# Altium project Robokinesis.PrjPcb
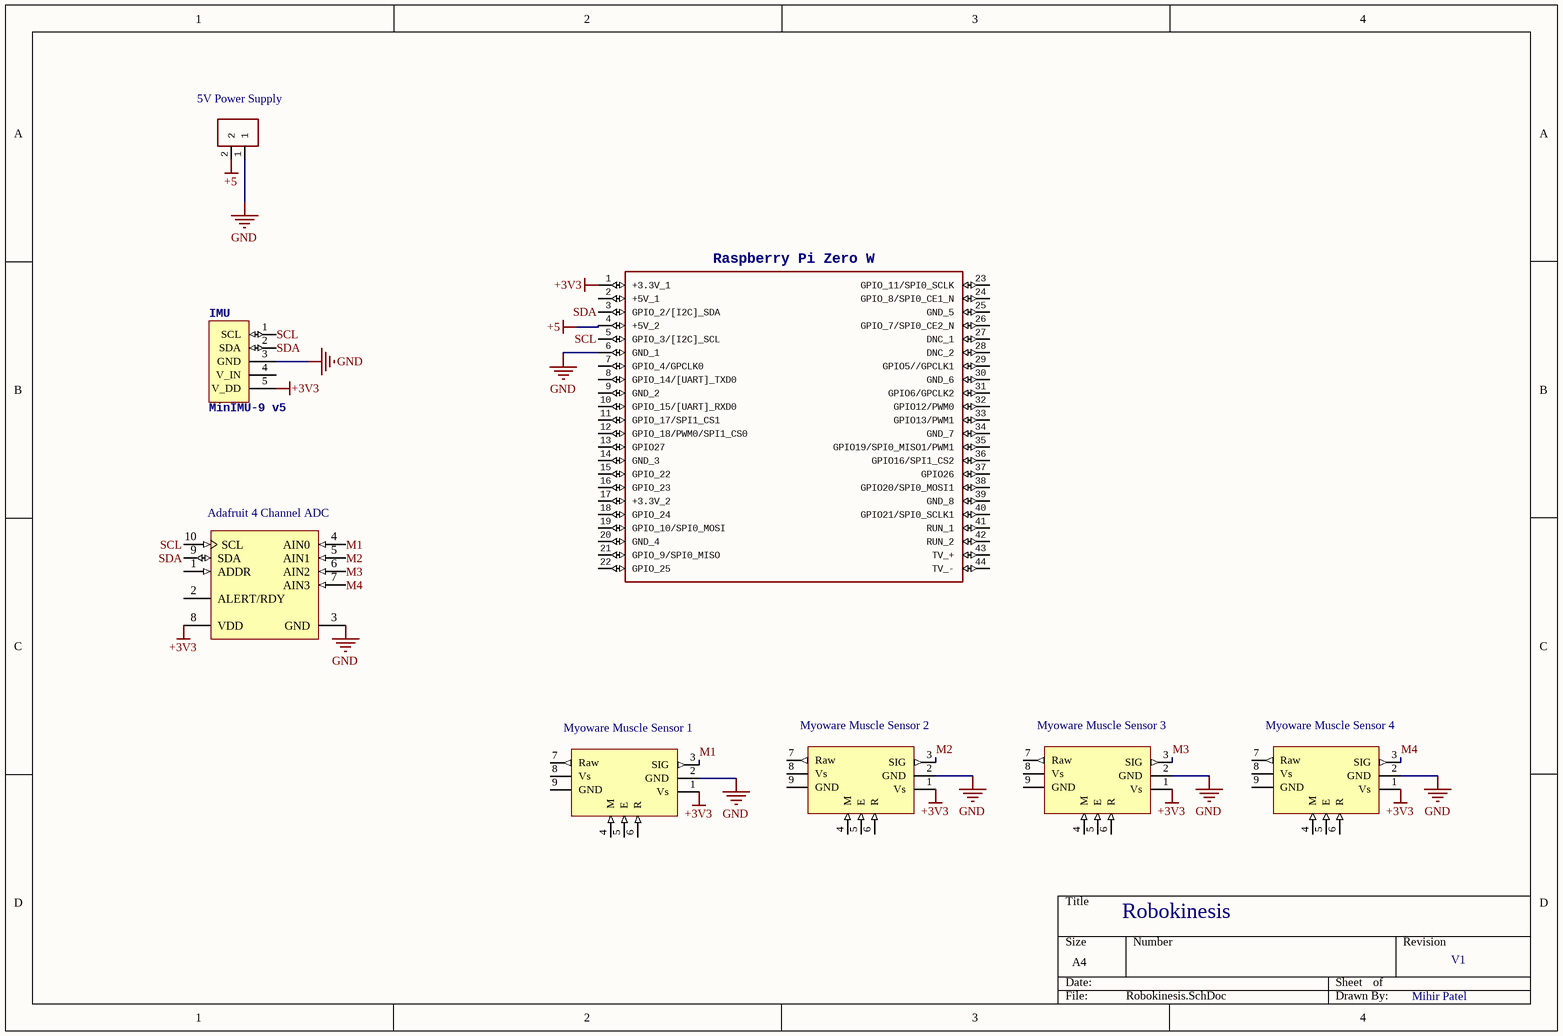
[diagram p0: Robokinesis.SchDoc]
1 sheet, 8 parts. Net scope: global (net labels, ports and power ports of the same name join across sheets).

## Sheet Robokinesis.SchDoc
size A4; SheetNumber: 1; SheetTotal: 1

### Parts
Adafruit_4_Channel_ADC  ADS1115IRUGT  [TI-RUG10_V]  (value not drawn)
IMU  MinIMU-9 v5  [HDR1X5]
Myoware_Muscle_Sensor_1  Myoware Muscle Sensor  (value not drawn)
Myoware_Muscle_Sensor_2  Myoware Muscle Sensor  (value not drawn)
Myoware_Muscle_Sensor_3  Myoware Muscle Sensor  (value not drawn)
Myoware_Muscle_Sensor_4  Myoware Muscle Sensor  (value not drawn)
Raspberry_Pi_Zero_W  Raspberry Pi Zero W (v1.3) Single-board Computers   Source:  Datasheet  [RASPBERRYPIZEROWV13]  (value not drawn)  (mechanical)
XT?  Connector 2 pins  [AMASS_XT60PB-M]  (value not drawn)

### Nets
+3V3: Adafruit_4_Channel_ADC.8(VDD) IMU.5(V_DD) Myoware_Muscle_Sensor_1.1(Vs) Myoware_Muscle_Sensor_2.1(Vs) Myoware_Muscle_Sensor_3.1(Vs) Myoware_Muscle_Sensor_4.1(Vs) Raspberry_Pi_Zero_W.1(+3.3V_1)
+5: Raspberry_Pi_Zero_W.4(+5V_2) XT?.2
GND: Adafruit_4_Channel_ADC.3(GND) IMU.3(GND) Myoware_Muscle_Sensor_1.2(GND) Myoware_Muscle_Sensor_2.2(GND) Myoware_Muscle_Sensor_3.2(GND) Myoware_Muscle_Sensor_4.2(GND) Raspberry_Pi_Zero_W.6(GND_1) XT?.1
M1: Adafruit_4_Channel_ADC.4(AIN0) Myoware_Muscle_Sensor_1.3(SIG)
M2: Adafruit_4_Channel_ADC.5(AIN1) Myoware_Muscle_Sensor_2.3(SIG)
M3: Adafruit_4_Channel_ADC.6(AIN2) Myoware_Muscle_Sensor_3.3(SIG)
M4: Adafruit_4_Channel_ADC.7(AIN3) Myoware_Muscle_Sensor_4.3(SIG)
SCL: Adafruit_4_Channel_ADC.10(SCL) IMU.1(SCL) Raspberry_Pi_Zero_W.5(GPIO_3/[I2C]_SCL)
SDA: Adafruit_4_Channel_ADC.9(SDA) IMU.2(SDA) Raspberry_Pi_Zero_W.3(GPIO_2/[I2C]_SDA)

Not connected (* = marked no-connect by the designer): Adafruit_4_Channel_ADC 1(ADDR) 2(ALERT/RDY); IMU 4(V_IN); Myoware_Muscle_Sensor_1 4(M) 5(E) 6(R) 7(Raw) 8(Vs) 9(GND); Myoware_Muscle_Sensor_2 4(M) 5(E) 6(R) 7(Raw) 8(Vs) 9(GND); Myoware_Muscle_Sensor_3 4(M) 5(E) 6(R) 7(Raw) 8(Vs) 9(GND); Myoware_Muscle_Sensor_4 4(M) 5(E) 6(R) 7(Raw) 8(Vs) 9(GND); Raspberry_Pi_Zero_W 2(+5V_1) 7(GPIO_4/GPCLK0) 8(GPIO_14/[UART]_TXD0) 9(GND_2) 10(GPIO_15/[UART]_RXD0) 11(GPIO_17/SPI1_CS1) 12(GPIO_18/PWM0/SPI1_CS0) 13(GPIO27) 14(GND_3) 15(GPIO_22) 16(GPIO_23) 17(+3.3V_2) 18(GPIO_24) 19(GPIO_10/SPI0_MOSI) 20(GND_4) 21(GPIO_9/SPI0_MISO) 22(GPIO_25) 23(GPIO_11/SPI0_SCLK) 24(GPIO_8/SPI0_CE1_N) 25(GND_5) 26(GPIO_7/SPI0_CE2_N) 27(DNC_1) 28(DNC_2) 29(GPIO5//GPCLK1) 30(GND_6) 31(GPIO6/GPCLK2) 32(GPIO12/PWM0) 33(GPIO13/PWM1) 34(GND_7) 35(GPIO19/SPI0_MISO1/PWM1) 36(GPIO16/SPI1_CS2) 37(GPIO26) 38(GPIO20/SPI0_MOSI1) 39(GND_8) 40(GPIO21/SPI0_SCLK1) 41(RUN_1) 42(RUN_2) 43(TV_+) 44(TV_-)

### Notes on the sheet
- (near XT?) 5V Power Supply
- Robokinesis
- V1
- Mihir Patel

### Library data of the parts
Adafruit_4_Channel_ADC = CMP-0003-00971-1: 16-Bit ADC with Integrated Multiplexer, PGA, Comparator, Oscillator, and Reference, -40 to 125 degC, 10-pin HandDrawn (RUG10), Green (RoHS & no Sb/Br); Manufacturer: Texas Instruments; INL(Max)(+/-LSB): 1; Digital Supply(Min)(V): 2; Resolution(Bits): 16; SubFamily: Precision ADC (<=10MSPS); # Input Channels: 4; Sample Rate (max)(SPS): 860; Analog Voltage AV/DD(Max)(V): 5.5; Architecture: Delta-Sigma; Interface: Serial I2C; Mounting Technology: Surface Mount; PartNumber: ADS1115IRUGT; ComponentLink1Description: Manufacturer URL; ComponentLink1URL: http://www.ti.com/; ComponentLink2URL: http://www.ti.com/general/docs/lit/getliterature.tsp?genericPartNumber=ADS1115&fileType=pdf; ComponentLink2Description: Datasheet; ComponentLink3URL: http://www.ti.com/litv/pdf/mpqf216a; PackageReference: RUG10; PackageDescription: 10-Pin Plastic Quad Flatpack, Body 1.5 x 2 mm, Pitch 0.5 mm; Analog Voltage AV/DD(Min)(V): 2; Digital Supply(Max)(V): 5.5; PackageVersion: 4208528-3/B, 04/2008; DatasheetVersion: SBAS444B; Code_JEDEC: MO-288; ComponentLink3Description: Package Specification; Eco-Plan: Green (RoHS & no Sb/Br)
IMU = Header 5: Header, 5-Pin; LatestRevisionDate: 17-Jul-2002; LatestRevisionNote: Re-released for DXP Platform.; Publisher: Altium Limited
Myoware_Muscle_Sensor_1-Myoware_Muscle_Sensor_4 = CMP-00028-00009-3: (AT-04-001)
Raspberry_Pi_Zero_W = RASPBERRY_PI_ZERO_W_(V1.3): Manufacturer_Name: RASPBERRY-PI; GateName_1: G$1; SymbolName_1: RASPBERRY_PI_ZERO_W_(V1.3); LibraryName: Raspberry_Pi_Zero_W_(v1.3); DeviceSetName: RASPBERRY_PI_ZERO_W_(V1.3); Package: RASPBERRYPIZEROWV13; Manufacturer_Part_Number: Raspberry Pi Zero W (v1.3); Height: mm; Parameter 1: *
XT? = XT60_YELLOW: GateName_1: G$1; MP: XT60 YELLOW; MF: Pololu; SymbolName_1: XT60_YELLOW; LibraryName: XT60_YELLOW; DeviceSetName: XT60_YELLOW; Package: AMASS_XT60PB-M; Availability: Unavailable; Price: None; Package: None